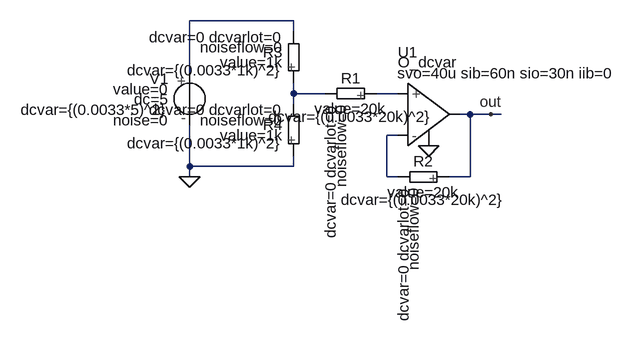
[diagram p0: schematic myFirstVampOPA211bias.asc]
myFirstVampOPA211bias.asc, the LTspice schematic file:
Version 4
SHEET 1 880 680
WIRE 16 32 -144 32
WIRE 16 48 16 32
WIRE -144 112 -144 32
WIRE 16 144 16 128
WIRE 64 144 16 144
WIRE 176 144 144 144
WIRE 16 160 16 144
WIRE 288 176 272 176
WIRE 320 176 288 176
WIRE 336 176 320 176
WIRE 176 208 160 208
WIRE -144 256 -144 192
WIRE 16 256 16 240
WIRE 16 256 -144 256
WIRE -144 272 -144 256
WIRE 160 272 160 208
WIRE 176 272 160 272
WIRE 288 272 288 176
WIRE 288 272 256 272
FLAG 224 224 0
FLAG -144 272 0
FLAG 320 176 out
SYMBOL SLO_dcvar 192 176 R0
SYMATTR InstName U1
SYMATTR Value svo=40u sib=60n sio=30n iib=0
SYMBOL SLV -144 112 M0
SYMATTR InstName V1
SYMATTR Value2 dc=5
SYMATTR SpiceLine dcvar={(0.0033*5)^2}
SYMBOL SLR_r 144 144 R90
WINDOW 0 -8 40 VBottom 2
WINDOW 3 8 40 VTop 2
WINDOW 123 20 40 VTop 2
SYMATTR InstName R1
SYMATTR Value value=20k
SYMATTR Value2 dcvar={(0.0033*20k)^2}
SYMBOL SLR_r 256 272 R90
WINDOW 0 -8 40 VBottom 2
WINDOW 3 8 40 VTop 2
WINDOW 123 20 40 VTop 2
SYMATTR InstName R2
SYMATTR Value value=20k
SYMATTR Value2 dcvar={(0.0033*20k)^2}
SYMBOL SLR_r 16 128 R180
WINDOW 0 16 48 Left 2
WINDOW 3 16 32 Left 2
WINDOW 123 16 20 Left 2
SYMATTR InstName R3
SYMATTR Value value=1k
SYMATTR Value2 dcvar={(0.0033*1k)^2}
SYMBOL SLR_r 16 240 R180
WINDOW 0 16 48 Left 2
WINDOW 3 16 32 Left 2
WINDOW 123 16 20 Left 2
SYMATTR InstName R4
SYMATTR Value value=1k
SYMATTR Value2 dcvar={(0.0033*1k)^2}

The netlist it stands for:
* myFirstVampOPA211bias.asc
XU1 N003 N004 out 0 O_dcvar svo=40u sib=60n sio=30n iib=0  ; pins NC+ NC- + -
V1 N001 0 V value=0 dc=5 dcvar={(0.0033*5)^2} noise=0
R1 N003 N002 r value=20k dcvar={(0.0033*20k)^2} noiseflow=0 dcvar=0 dcvarlot=0
R2 out N004 r value=20k dcvar={(0.0033*20k)^2} noiseflow=0 dcvar=0 dcvarlot=0
R3 N002 N001 r value=1k dcvar={(0.0033*1k)^2} noiseflow=0 dcvar=0 dcvarlot=0
R4 0 N002 r value=1k dcvar={(0.0033*1k)^2} noiseflow=0 dcvar=0 dcvarlot=0
.backanno
.end